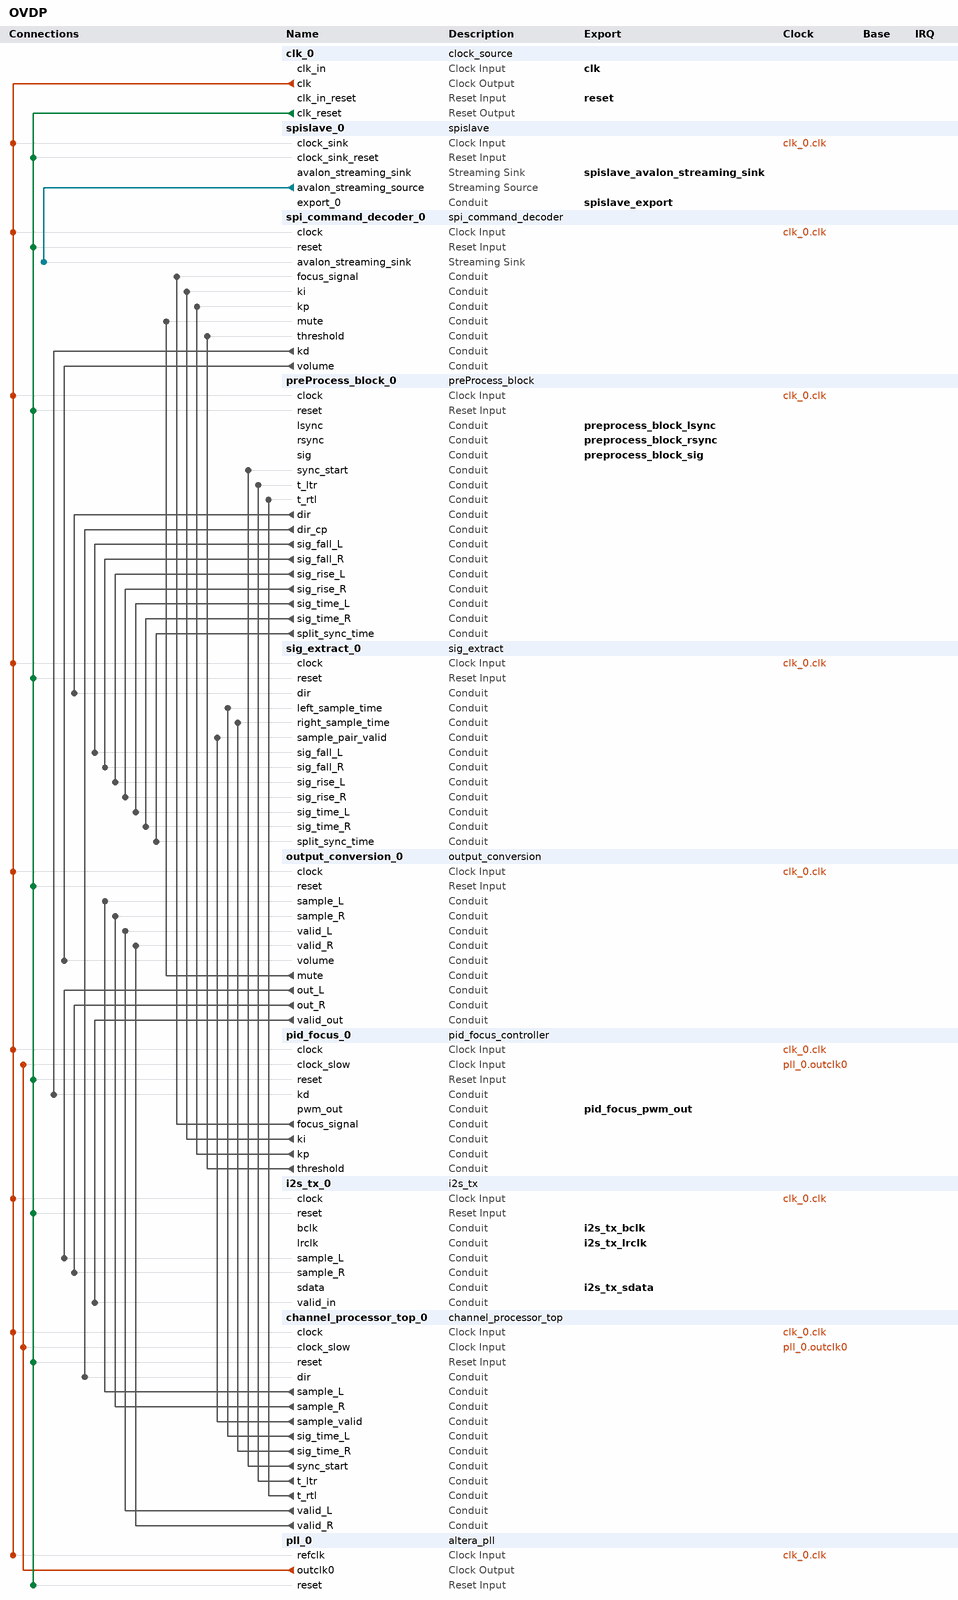
[diagram p0: system contents]
# Platform Designer (Qsys) system OVDP, Cyclone V 5CSEMA5F31C6
# Parameters at their usual value, and those the tool derives, are not listed.
package require -exact qsys 18.1
create_system OVDP
set_project_property DEVICE_FAMILY {Cyclone V}
set_project_property DEVICE 5CSEMA5F31C6

add_instance clk_0 clock_source 18.1
set_instance_parameter_value clk_0 clockFrequency 100000000

add_instance spislave_0 spislave 18.1
set_instance_parameter_value spislave_0 SYNC_DEPTH 3

add_instance spi_command_decoder_0 spi_command_decoder 1.0

add_instance preProcess_block_0 preProcess_block 1.0

add_instance sig_extract_0 sig_extract 1.0

add_instance output_conversion_0 output_conversion 1.0

add_instance pid_focus_0 pid_focus_controller 1.0

add_instance i2s_tx_0 i2s_tx 1.0

add_instance channel_processor_top_0 channel_processor_top 1.0

add_instance pll_0 altera_pll 18.1
set_instance_parameter_value pll_0 gui_device_speed_grade 1
set_instance_parameter_value pll_0 gui_number_of_clocks 1
set_instance_parameter_value pll_0 gui_operation_mode direct
set_instance_parameter_value pll_0 gui_output_clock_frequency0 5.0
set_instance_parameter_value pll_0 gui_pll_mode {Integer-N PLL}
set_instance_parameter_value pll_0 gui_reference_clock_frequency 100.0
set_instance_parameter_value pll_0 gui_use_locked false

# connections
add_connection clk_0.clk channel_processor_top_0.clock clock
add_connection clk_0.clk i2s_tx_0.clock clock
add_connection clk_0.clk output_conversion_0.clock clock
add_connection clk_0.clk pid_focus_0.clock clock
add_connection clk_0.clk pll_0.refclk clock
add_connection clk_0.clk preProcess_block_0.clock clock
add_connection clk_0.clk sig_extract_0.clock clock
add_connection clk_0.clk spi_command_decoder_0.clock clock
add_connection clk_0.clk spislave_0.clock_sink clock
add_connection pll_0.outclk0 channel_processor_top_0.clock_slow clock
add_connection pll_0.outclk0 pid_focus_0.clock_slow clock
add_connection clk_0.clk_reset channel_processor_top_0.reset reset
add_connection clk_0.clk_reset i2s_tx_0.reset reset
add_connection clk_0.clk_reset output_conversion_0.reset reset
add_connection clk_0.clk_reset pid_focus_0.reset reset
add_connection clk_0.clk_reset pll_0.reset reset
add_connection clk_0.clk_reset preProcess_block_0.reset reset
add_connection clk_0.clk_reset sig_extract_0.reset reset
add_connection clk_0.clk_reset spi_command_decoder_0.reset reset
add_connection clk_0.clk_reset spislave_0.clock_sink_reset reset
add_connection spislave_0.avalon_streaming_source spi_command_decoder_0.avalon_streaming_sink avalon_streaming
add_connection channel_processor_top_0.sample_L output_conversion_0.sample_L conduit
add_connection channel_processor_top_0.sample_R output_conversion_0.sample_R conduit
add_connection channel_processor_top_0.sample_valid sig_extract_0.sample_pair_valid conduit
add_connection channel_processor_top_0.sig_time_L sig_extract_0.left_sample_time conduit
add_connection channel_processor_top_0.sig_time_R sig_extract_0.right_sample_time conduit
add_connection channel_processor_top_0.sync_start preProcess_block_0.sync_start conduit
add_connection channel_processor_top_0.t_ltr preProcess_block_0.t_ltr conduit
add_connection channel_processor_top_0.t_rtl preProcess_block_0.t_rtl conduit
add_connection channel_processor_top_0.valid_L output_conversion_0.valid_L conduit
add_connection channel_processor_top_0.valid_R output_conversion_0.valid_R conduit
add_connection output_conversion_0.mute spi_command_decoder_0.mute conduit
add_connection output_conversion_0.out_L i2s_tx_0.sample_L conduit
add_connection output_conversion_0.out_R i2s_tx_0.sample_R conduit
add_connection output_conversion_0.valid_out i2s_tx_0.valid_in conduit
add_connection pid_focus_0.focus_signal spi_command_decoder_0.focus_signal conduit
add_connection pid_focus_0.ki spi_command_decoder_0.ki conduit
add_connection pid_focus_0.kp spi_command_decoder_0.kp conduit
add_connection pid_focus_0.threshold spi_command_decoder_0.threshold conduit
add_connection preProcess_block_0.dir sig_extract_0.dir conduit
add_connection preProcess_block_0.dir_cp channel_processor_top_0.dir conduit
add_connection preProcess_block_0.sig_fall_L sig_extract_0.sig_fall_L conduit
add_connection preProcess_block_0.sig_fall_R sig_extract_0.sig_fall_R conduit
add_connection preProcess_block_0.sig_rise_L sig_extract_0.sig_rise_L conduit
add_connection preProcess_block_0.sig_rise_R sig_extract_0.sig_rise_R conduit
add_connection preProcess_block_0.sig_time_L sig_extract_0.sig_time_L conduit
add_connection preProcess_block_0.sig_time_R sig_extract_0.sig_time_R conduit
add_connection preProcess_block_0.split_sync_time sig_extract_0.split_sync_time conduit
add_connection spi_command_decoder_0.kd pid_focus_0.kd conduit
add_connection spi_command_decoder_0.volume output_conversion_0.volume conduit

# exported interfaces
add_interface clk clock sink
set_interface_property clk EXPORT_OF clk_0.clk_in
add_interface i2s_tx_bclk conduit end
set_interface_property i2s_tx_bclk EXPORT_OF i2s_tx_0.bclk
add_interface i2s_tx_lrclk conduit end
set_interface_property i2s_tx_lrclk EXPORT_OF i2s_tx_0.lrclk
add_interface i2s_tx_sdata conduit end
set_interface_property i2s_tx_sdata EXPORT_OF i2s_tx_0.sdata
add_interface pid_focus_pwm_out conduit end
set_interface_property pid_focus_pwm_out EXPORT_OF pid_focus_0.pwm_out
add_interface preprocess_block_lsync conduit end
set_interface_property preprocess_block_lsync EXPORT_OF preProcess_block_0.lsync
add_interface preprocess_block_rsync conduit end
set_interface_property preprocess_block_rsync EXPORT_OF preProcess_block_0.rsync
add_interface preprocess_block_sig conduit end
set_interface_property preprocess_block_sig EXPORT_OF preProcess_block_0.sig
add_interface reset reset sink
set_interface_property reset EXPORT_OF clk_0.clk_in_reset
add_interface spislave_avalon_streaming_sink avalon_streaming sink
set_interface_property spislave_avalon_streaming_sink EXPORT_OF spislave_0.avalon_streaming_sink
add_interface spislave_export conduit end
set_interface_property spislave_export EXPORT_OF spislave_0.export_0

set_interconnect_requirement {$system} qsys_mm.clockCrossingAdapter HANDSHAKE
set_interconnect_requirement {$system} qsys_mm.enableEccProtection FALSE
set_interconnect_requirement {$system} qsys_mm.insertDefaultSlave FALSE
set_interconnect_requirement {$system} qsys_mm.maxAdditionalLatency 1

save_system OVDP.qsys
